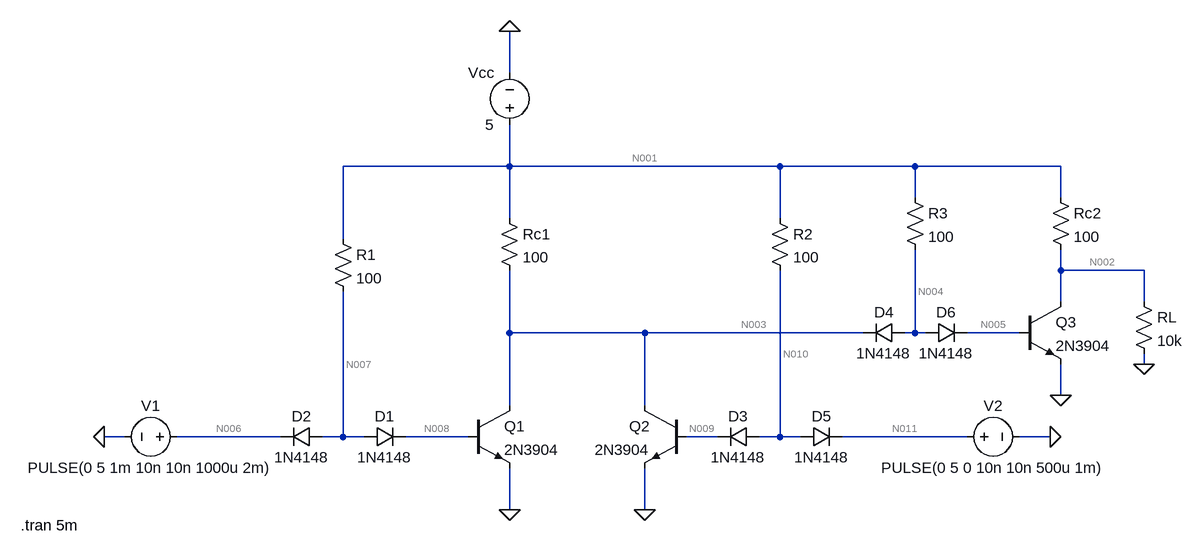
[diagram p0: schematic DTL_OR.asc]
DTL_OR.asc, the LTspice schematic file:
Version 4
SHEET 1 1056 680
WIRE -32 -304 -32 -368
WIRE -32 -160 -32 -224
WIRE -32 -160 -288 -160
WIRE 384 -160 -32 -160
WIRE 592 -160 384 -160
WIRE 816 -160 592 -160
WIRE 592 -112 592 -160
WIRE 816 -112 816 -160
WIRE -32 -80 -32 -160
WIRE 384 -80 384 -160
WIRE -288 -48 -288 -160
WIRE 816 0 816 -32
WIRE 944 0 816 0
WIRE 816 48 816 0
WIRE 944 48 944 0
WIRE -32 96 -32 0
WIRE 176 96 -32 96
WIRE 512 96 176 96
WIRE 592 96 592 -32
WIRE 592 96 576 96
WIRE 608 96 592 96
WIRE 752 96 672 96
WIRE 944 144 944 128
WIRE 816 192 816 144
WIRE -32 208 -32 96
WIRE 176 208 176 96
WIRE -624 256 -656 256
WIRE -384 256 -544 256
WIRE -288 256 -288 32
WIRE -288 256 -320 256
WIRE -256 256 -288 256
WIRE -96 256 -192 256
WIRE 288 256 240 256
WIRE 384 256 384 0
WIRE 384 256 352 256
WIRE 416 256 384 256
WIRE 672 256 480 256
WIRE 800 256 752 256
WIRE -32 368 -32 304
WIRE 176 368 176 304
FLAG -656 256 0
FLAG -32 -368 0
FLAG -32 368 0
FLAG 176 368 0
FLAG 816 192 0
FLAG 800 256 0
FLAG 944 144 0
SYMBOL diode -256 272 R270
WINDOW 0 32 32 VTop 2
WINDOW 3 0 32 VBottom 2
SYMATTR InstName D1
SYMATTR Value 1N4148
SYMBOL voltage -528 256 R90
WINDOW 0 -32 56 VBottom 2
WINDOW 3 32 56 VTop 2
SYMATTR InstName V1
SYMATTR Value PULSE(0 5 1m 10n 10n 1000u 2m)
SYMBOL res -304 -64 R0
SYMATTR InstName R1
SYMATTR Value 100
SYMBOL voltage -32 -208 R180
WINDOW 0 24 96 Left 2
WINDOW 3 24 16 Left 2
WINDOW 123 0 0 Left 0
WINDOW 39 0 0 Left 0
SYMATTR InstName Vcc
SYMATTR Value 5
SYMBOL res -48 -96 R0
SYMATTR InstName Rc1
SYMATTR Value 100
SYMBOL npn -96 208 R0
SYMATTR InstName Q1
SYMATTR Value 2N3904
SYMBOL res 368 -96 R0
SYMATTR InstName R2
SYMATTR Value 100
SYMBOL npn 240 208 M0
SYMATTR InstName Q2
SYMATTR Value 2N3904
SYMBOL voltage 656 256 R270
WINDOW 0 32 56 VTop 2
WINDOW 3 -32 56 VBottom 2
SYMATTR InstName V2
SYMATTR Value PULSE(0 5 0 10n 10n 500u 1m)
SYMBOL res 576 -128 R0
SYMATTR InstName R3
SYMATTR Value 100
SYMBOL res 800 -128 R0
SYMATTR InstName Rc2
SYMATTR Value 100
SYMBOL npn 752 48 R0
SYMATTR InstName Q3
SYMATTR Value 2N3904
SYMBOL diode -320 240 R90
WINDOW 0 0 32 VBottom 2
WINDOW 3 32 32 VTop 2
SYMATTR InstName D2
SYMATTR Value 1N4148
SYMBOL diode 352 240 R90
WINDOW 0 0 32 VBottom 2
WINDOW 3 32 32 VTop 2
SYMATTR InstName D3
SYMATTR Value 1N4148
SYMBOL diode 576 80 R90
WINDOW 0 0 32 VBottom 2
WINDOW 3 32 32 VTop 2
SYMATTR InstName D4
SYMATTR Value 1N4148
SYMBOL diode 416 272 R270
WINDOW 0 32 32 VTop 2
WINDOW 3 0 32 VBottom 2
SYMATTR InstName D5
SYMATTR Value 1N4148
SYMBOL diode 608 112 R270
WINDOW 0 32 32 VTop 2
WINDOW 3 0 32 VBottom 2
SYMATTR InstName D6
SYMATTR Value 1N4148
SYMBOL res 928 32 R0
SYMATTR InstName RL
SYMATTR Value 10k
TEXT -784 392 Left 2 !.tran 5m

The netlist it stands for:
* DTL_OR.asc
D1 N007 N008 1N4148
V1 N006 0 PULSE(0 5 1m 10n 10n 1000u 2m)
R1 N001 N007 100
Vcc N001 0 5
Rc1 N001 N003 100
Q1 N003 N008 0 0 2N3904
R2 N001 N010 100
Q2 N003 N009 0 0 2N3904
V2 N011 0 PULSE(0 5 0 10n 10n 500u 1m)
R3 N001 N004 100
Rc2 N001 N002 100
Q3 N002 N005 0 0 2N3904
D2 N007 N006 1N4148
D3 N010 N009 1N4148
D4 N004 N003 1N4148
D5 N010 N011 1N4148
D6 N004 N005 1N4148
RL N002 0 10k
.model D D
.lib standard.dio
.model NPN NPN
.model PNP PNP
.lib standard.bjt
.tran 5m
.backanno
.end

* Results of the author's LTspice run, read from the files saved beside the schematic
* Operating Point, zero values left out:
*   V(n007) = 777.8 mV
*   V(n008) = 581.1 mV
*   V(n001) = 5 V
*   V(n003) = 4.988 V
*   V(n010) = 777.8 mV
*   V(n009) = 581.1 mV
*   V(n004) = 2.129 V
*   V(n002) = 30.43 mV
*   V(n005) = 1.377 V
*   Ic(Q3) = 49.69 mA
*   Ib(Q3) = 28.71 mA
*   Ie(Q3) = -78.4 mA
*   Ic(Q2) = 59.71 µA
*   Ib(Q2) = 190.7 nA
*   Ie(Q2) = -59.91 µA
*   Ic(Q1) = 59.71 µA
*   Ib(Q1) = 190.7 nA
*   Ie(Q1) = -59.91 µA
*   I(D6) = 28.71 mA
*   I(D5) = 42.22 mA
*   I(D4) = -2.523 nA
*   I(D3) = 190.7 nA
*   I(D2) = 42.22 mA
*   I(D1) = 190.7 nA
*   I(Rl) = 3.043 µA
*   I(Rc2) = 49.7 mA
*   I(R3) = 28.71 mA
*   I(R2) = 42.22 mA
*   I(Rc1) = 119.4 µA
*   I(R1) = 42.22 mA
*   I(V2) = 42.22 mA
*   I(Vcc) = -163 mA
*   I(V1) = 42.22 mA
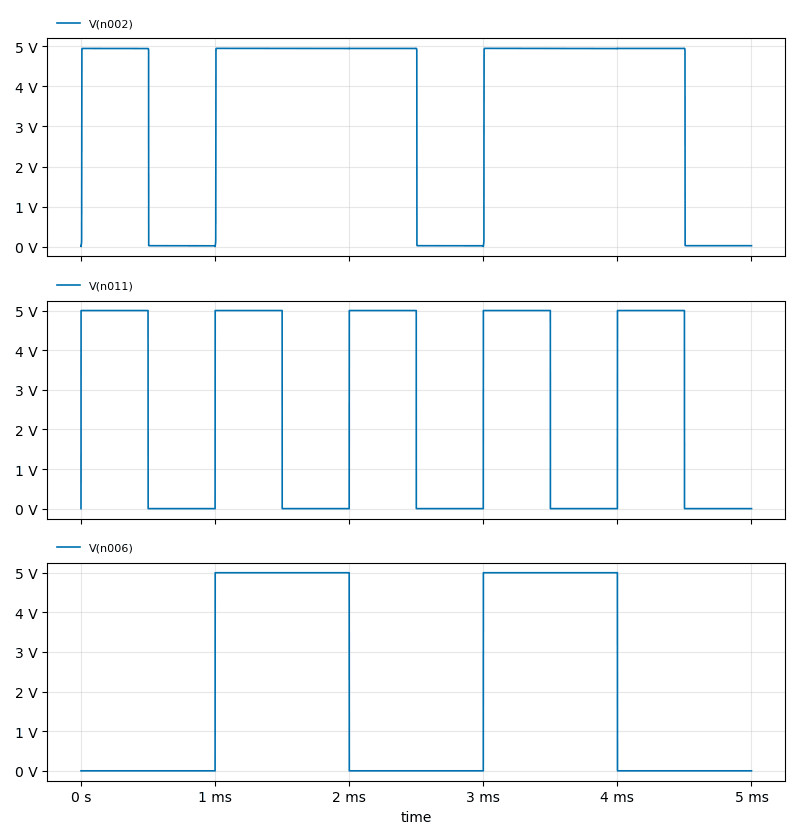
[diagram p1: Transient Analysis of DTL_OR.asc, plotted from the saved traces]
* Transient Analysis, 1 run:
*   V(n002): min 12.26 mV, max 4.942 V, average 3.465 V, rms 4.131 V, last 30.43 mV
*   V(n011): min 0 V, max 5 V, average 2.5 V, rms 3.536 V, last 0 V
*   V(n006): min 0 V, max 5 V, average 2 V, rms 3.162 V, last 0 V